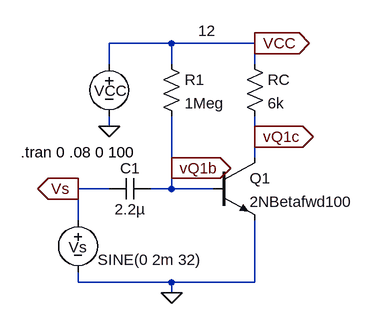
[diagram p0: schematic blitz02.asc]
blitz02.asc, the LTspice schematic file:
Version 4
SHEET 1 880 680
WIRE 144 -48 48 -48
WIRE 272 -48 144 -48
WIRE 48 -16 48 -48
WIRE 144 -16 144 -48
WIRE 272 -16 272 -48
WIRE 48 80 48 64
WIRE 272 96 272 64
WIRE 272 128 272 96
WIRE 144 144 144 64
WIRE 48 176 0 176
WIRE 144 176 144 144
WIRE 144 176 112 176
WIRE 208 176 144 176
WIRE 0 224 0 176
WIRE 0 320 0 304
WIRE 144 320 0 320
WIRE 272 320 272 224
WIRE 272 320 144 320
WIRE 144 336 144 320
FLAG 48 80 0
FLAG 144 336 0
FLAG 272 96 vQ1c
IOPIN 272 96 Out
FLAG 144 144 vQ1b
IOPIN 144 144 Out
FLAG 0 176 Vs
IOPIN 0 176 Out
FLAG 272 -48 VCC
IOPIN 272 -48 Out
SYMBOL npn 208 128 R0
SYMATTR InstName Q1
SYMATTR Value 2NBetafwd100
SYMBOL voltage 0 208 R0
WINDOW 0 -14 58 Left 2
WINDOW 3 30 77 Left 2
WINDOW 123 0 0 Left 0
WINDOW 39 0 0 Left 0
SYMATTR InstName Vs
SYMATTR Value SINE(0 2m 32)
SYMBOL voltage 48 -32 R0
WINDOW 0 -23 57 Left 2
WINDOW 3 137 -35 Left 2
SYMATTR InstName VCC
SYMATTR Value 12
SYMBOL res 256 -32 R0
SYMATTR InstName RC
SYMATTR Value 6k
SYMBOL res 128 -32 R0
SYMATTR InstName R1
SYMATTR Value 1Meg
SYMBOL cap 112 160 R90
WINDOW 0 0 32 VBottom 2
WINDOW 3 32 32 VTop 2
SYMATTR InstName C1
SYMATTR Value 2.2µ
TEXT -88 120 Left 2 !.tran 0 .08 0 100

The netlist it stands for:
* blitz02.asc
Q1 vQ1c vQ1b 0 0 2NBetafwd100
Vs Vs 0 SINE(0 2m 32)
VCC VCC 0 12
RC VCC vQ1c 6k
R1 VCC vQ1b 1Meg
C1 vQ1b Vs 2.2µ
.model NPN NPN
.model PNP PNP
.lib standard.bjt
.tran 0 .08 0 100
.backanno
.end